# EAGLE schematic blink1mk2_v2d (EAGLE 6.4)
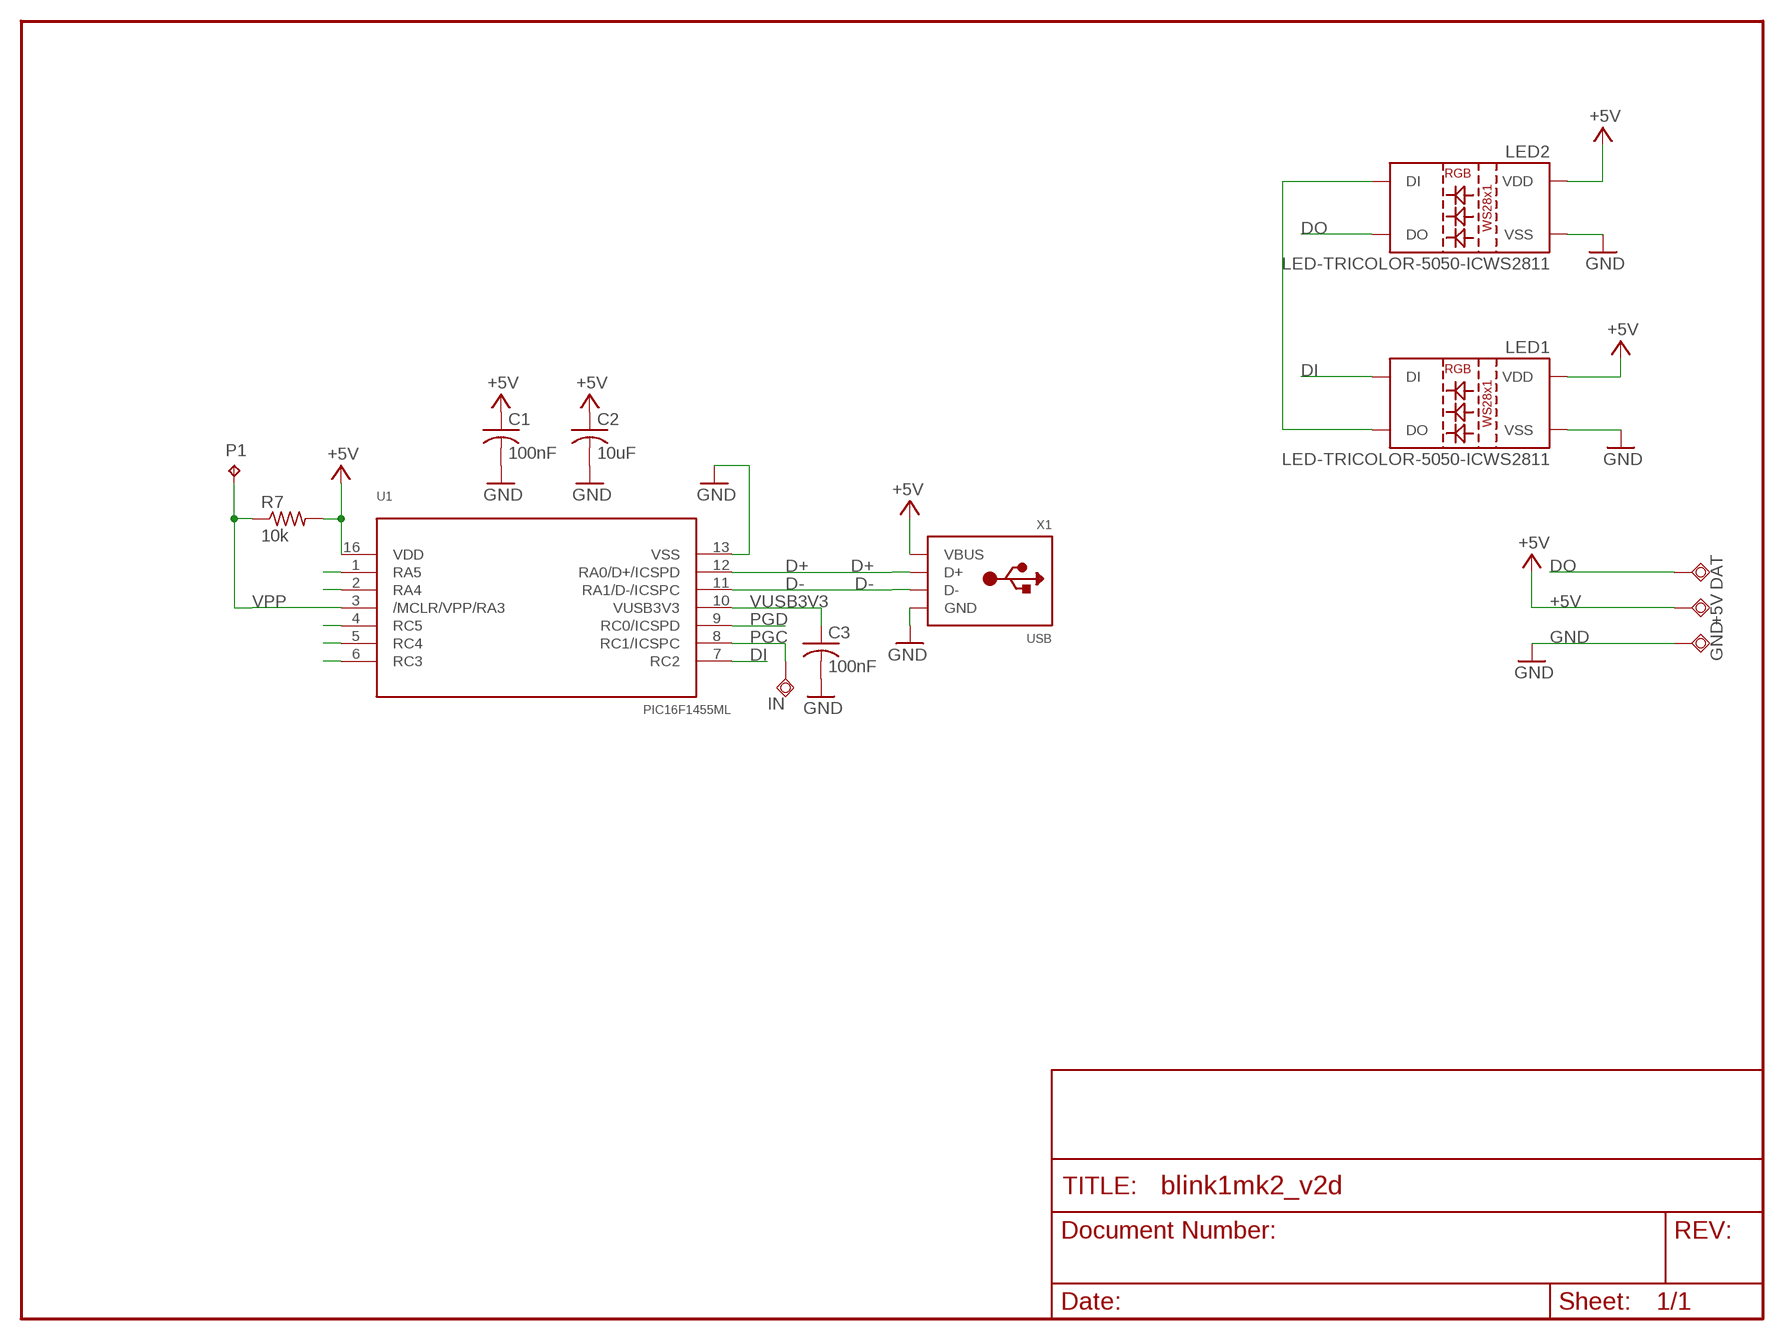
[diagram p0: schematic, sheet 1]

## Parts
+5V  TPSQTP12SQ  [TP12SQ]
C1  100nF  C-USC0603  [C0603]
C2  10uF  C-USC0603  [C0603]
C3  100nF  C-USC0603  [C0603]
DAT  TPSQTP12SQ  [TP12SQ]
GND  TPSQTP12SQ  [TP12SQ]
IN  TPSQTP12SQ  [TP12SQ]
LED1  LED-TRICOLOR-5050-ICWS2811  [LED-TRICOLOR-5050-IC]
LED2  LED-TRICOLOR-5050-ICWS2811  [LED-TRICOLOR-5050-IC]
P1  TPTP11SQ  [TP11SQ]
R7  10k  R-US_R0603  [R0603]
U1  PIC16F1455ML  [QFN16_4X4]
X1  USB  [MOLEX-48037-1000]

## Nets
+5V: +5V.TP C1.1 C2.1 LED1.3(VDD) LED1.5(VDD) LED2.3(VDD) LED2.5(VDD) R7.2 U1.16(VDD) X1.1(VBUS)
D+: U1.12(RA0/D+/ICSPD) X1.3(D+)
D-: U1.11(RA1/D-/ICSPC) X1.2(D-)
DI: LED1.2(DI) U1.7(RC2)
DO: DAT.TP LED2.1(DO)
GND: C1.2 C2.2 C3.2 GND.TP LED1.6(VSS) LED2.6(VSS) U1.13(VSS) X1.4(GND)
N$1: LED1.1(DO) LED2.2(DI)
N$2: U1.1(RA5)
N$3: U1.6(RC3)
N$4: U1.5(RC4)
N$5: U1.2(RA4)
N$6: U1.4(RC5)
PGC: IN.TP U1.8(RC1/ICSPC)
PGD: U1.9(RC0/ICSPD)
VPP: P1.TP R7.1 U1.3(/MCLR/VPP/RA3)
VUSB3V3: C3.1 U1.10(VUSB3V3)

## Library data of the parts
+5V DAT GND IN = testpad:TPSQ: Test pad
C1-C3 = rcl:C-US: CAPACITOR, American symbol
LED1 LED2 = SparkFun-LED:LED-TRICOLOR-5050-IC: 5x5mm SMD LED with built-in controller IC.
P1 = testpad:TP: Test pad
R7 = rcl:R-US_: RESISTOR, American symbol
U1 = todstuffnew:PIC16F1455
X1 = todstuff:USB